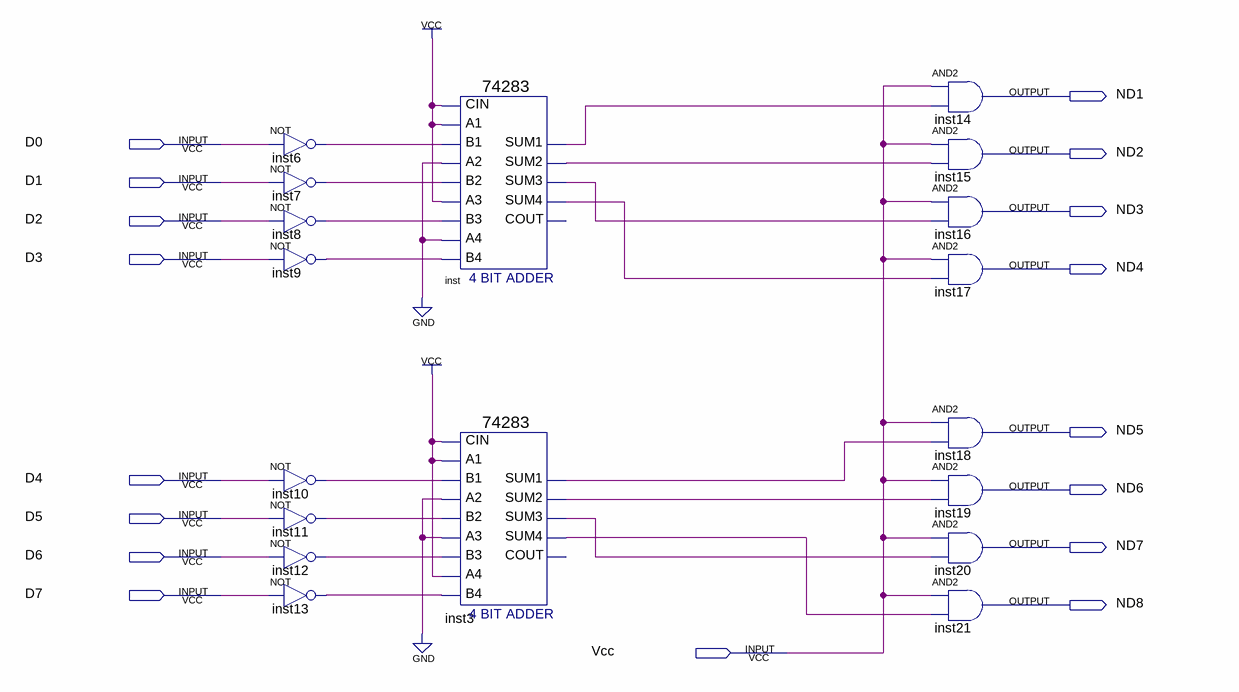
[diagram p0: schematic sheet]
// Quartus schematic TransGreen.bdf as structural Verilog: 18 symbols, 17 pins
module TransGreen (
  input  D0,
  input  D1,
  input  D2,
  input  D3,
  input  D4,
  input  D5,
  input  D6,
  input  D7,
  input  Vcc,
  output ND1,
  output ND2,
  output ND3,
  output ND4,
  output ND5,
  output ND6,
  output ND7,
  output ND8
);

  wire inst3_sum1, inst3_sum2, inst3_sum3, inst3_sum4, inst6_out, inst7_out, inst8_out, inst9_out,
       inst10_out, inst11_out, inst12_out, inst13_out, inst_sum1, inst_sum2, inst_sum3, inst_sum4;

  not inst6 (inst6_out, D0);
  not inst7 (inst7_out, D1);
  not inst8 (inst8_out, D2);
  not inst9 (inst9_out, D3);
  not inst10 (inst10_out, D4);
  not inst11 (inst11_out, D5);
  not inst12 (inst12_out, D6);
  not inst13 (inst13_out, D7);
  \74283  inst (
    .CIN(1'b1), .A1(1'b1), .A2(1'b0), .B2(inst7_out), .A3(1'b1), .A4(1'b0), .B4(inst9_out), .B1(inst6_out),
    .B3(inst8_out), .SUM4(inst_sum4), .SUM1(inst_sum1), .SUM2(inst_sum2), .SUM3(inst_sum3));  // open: COUT
  \74283  inst3 (
    .CIN(1'b1), .A1(1'b1), .A2(1'b0), .B2(inst11_out), .A3(1'b0), .A4(1'b1), .B4(inst13_out),
    .B1(inst10_out), .B3(inst12_out), .SUM4(inst3_sum4), .SUM1(inst3_sum1), .SUM2(inst3_sum2),
    .SUM3(inst3_sum3));  // open: COUT
  and inst14 (ND1, Vcc, inst_sum1);
  and inst15 (ND2, Vcc, inst_sum2);
  and inst16 (ND3, Vcc, inst_sum3);
  and inst17 (ND4, Vcc, inst_sum4);
  and inst18 (ND5, Vcc, inst3_sum1);
  and inst19 (ND6, Vcc, inst3_sum2);
  and inst20 (ND7, Vcc, inst3_sum3);
  and inst21 (ND8, Vcc, inst3_sum4);
endmodule
